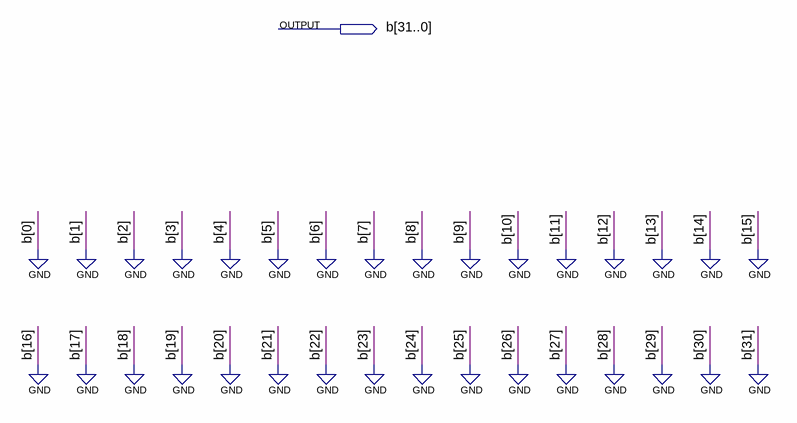
[diagram p0: schematic sheet]
// Quartus schematic gnd32.bdf as structural Verilog: 0 symbols, 1 pins
module gnd32 (
  output [31:0] b
);


  assign b = {32{1'b0}};
endmodule
